# EasyEDA Pro project design.epro, schematic board_bottom_schematic

## Sheets
1 microcontroller: Board Name: board_bottom; Create Date: 2025-03-20; Page Name: microcontroller; Project Name: macropad-final; Schematic Name: board_bottom_schematic; Update Date: 2025-03-23; Company: EasyEDA.com; Page Size: A4; Version: V1.0
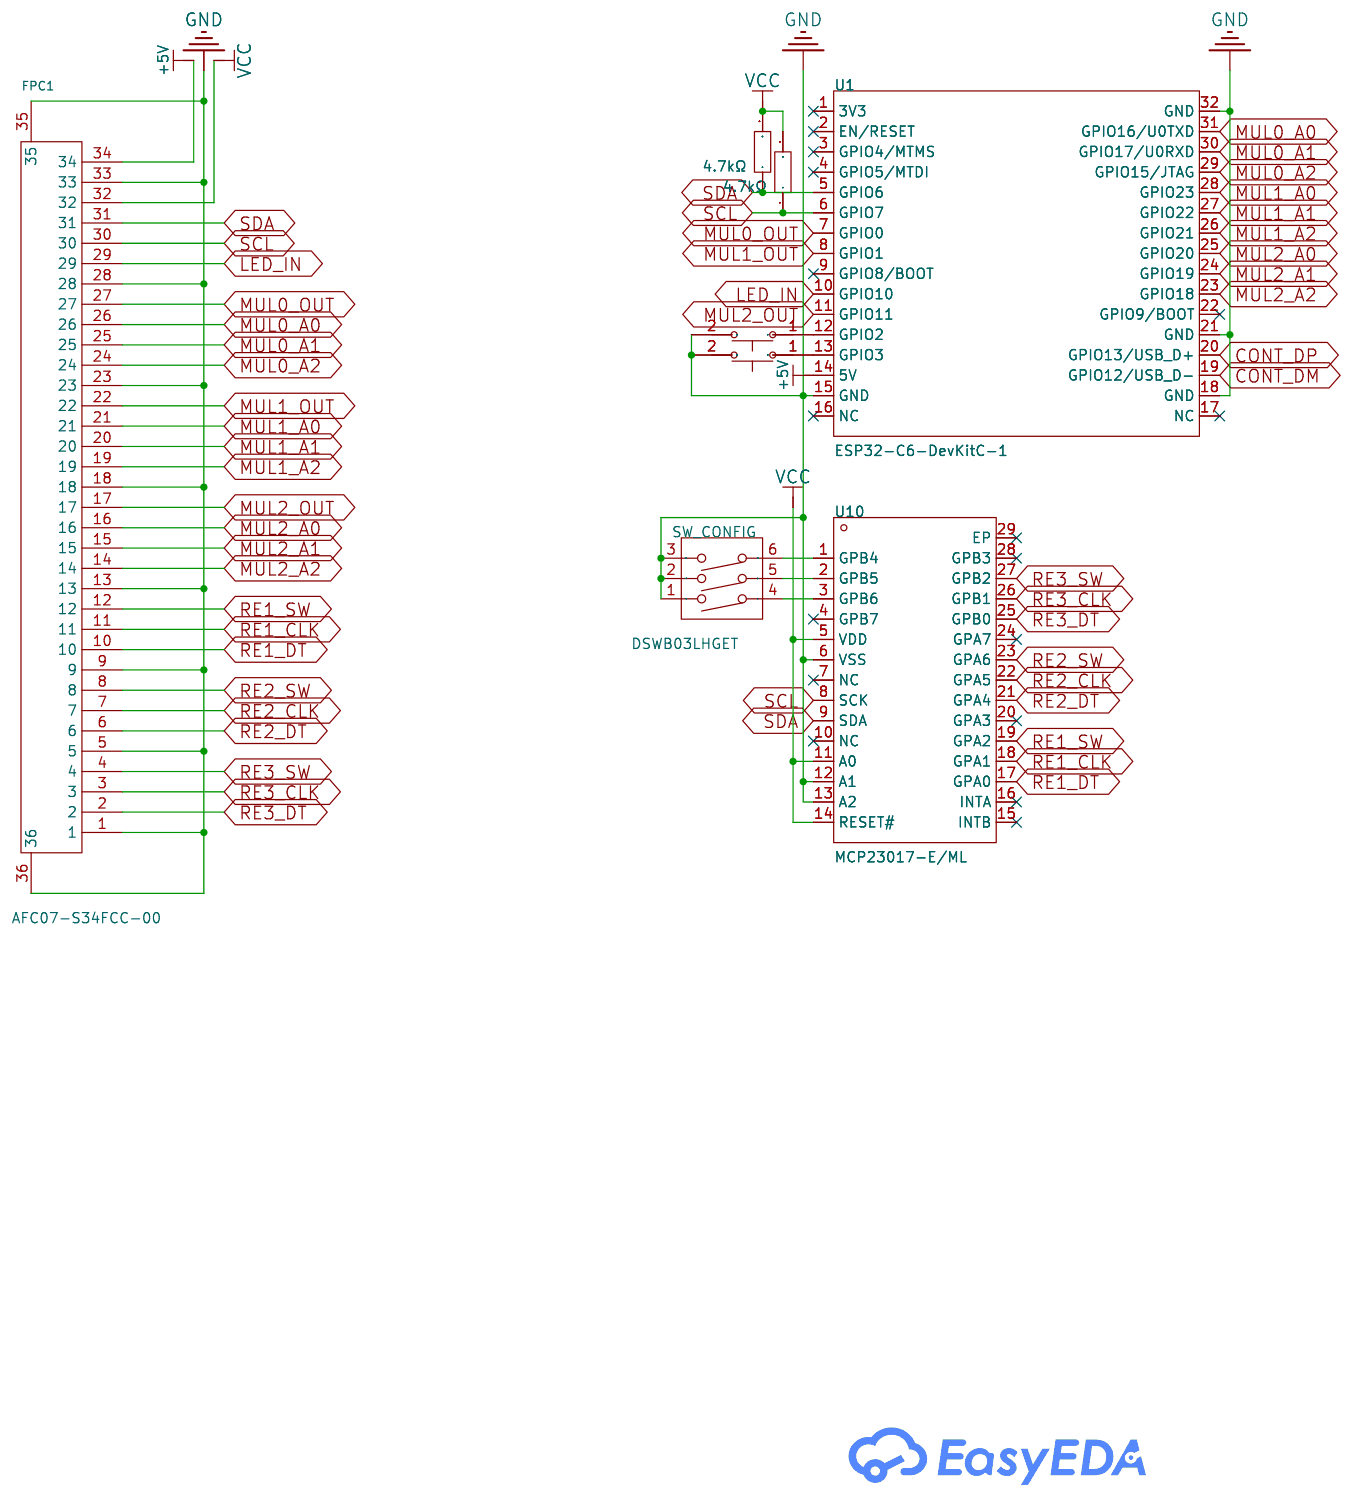
[diagram p0: microcontroller]
2 usb_hub: Create Date: 2025-03-21; Page Name: usb_hub
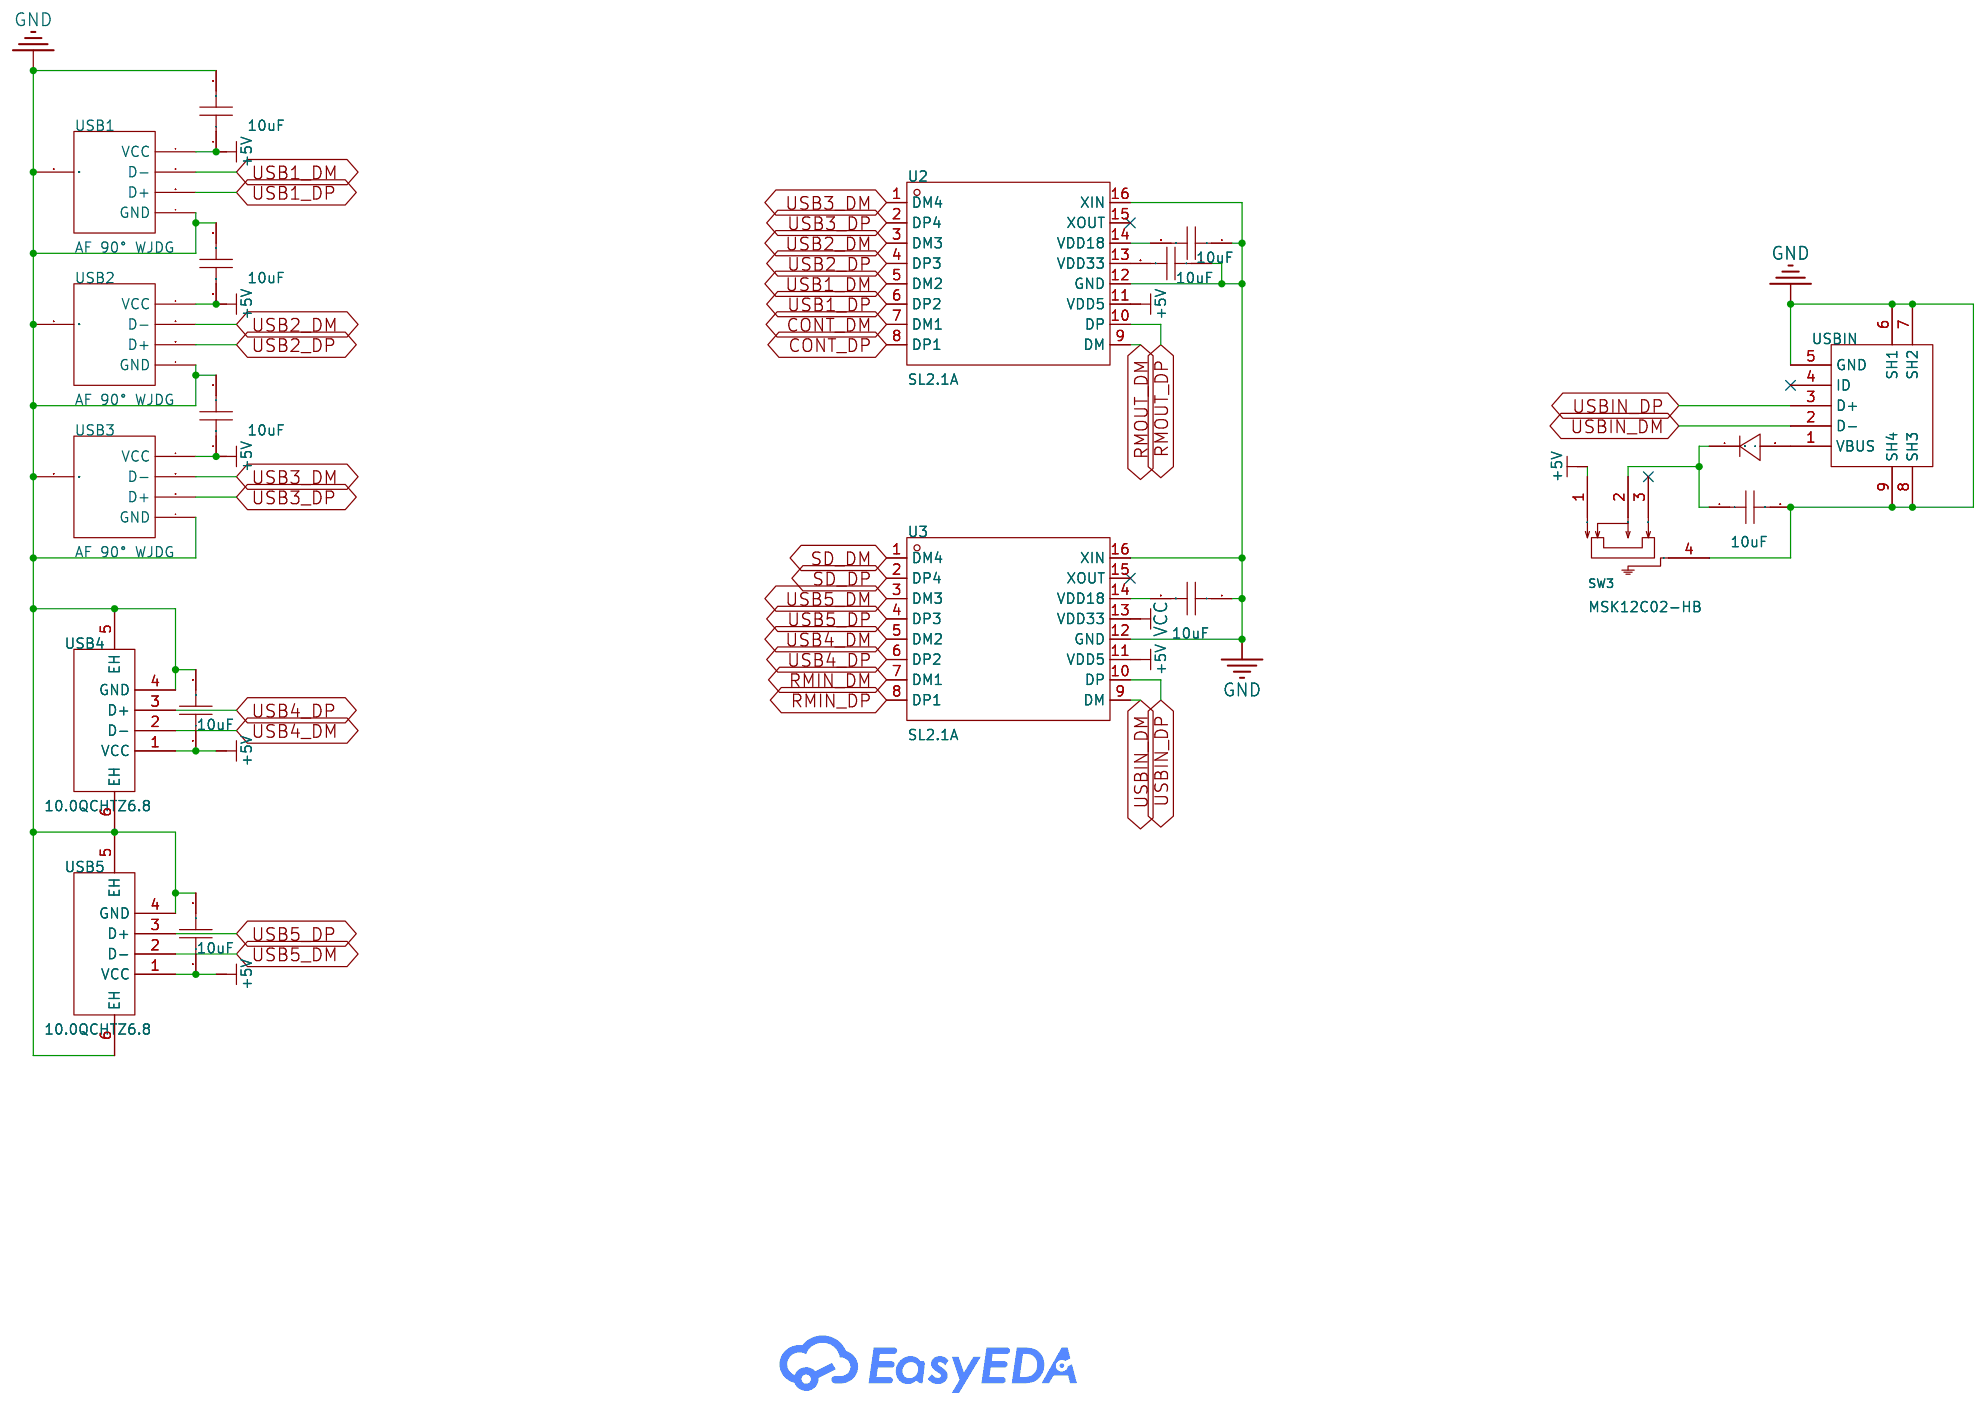
[diagram p1: usb_hub]
3 sd_reader: Create Date: 2025-03-21; Page Name: sd_reader; Update Date: 2025-03-22
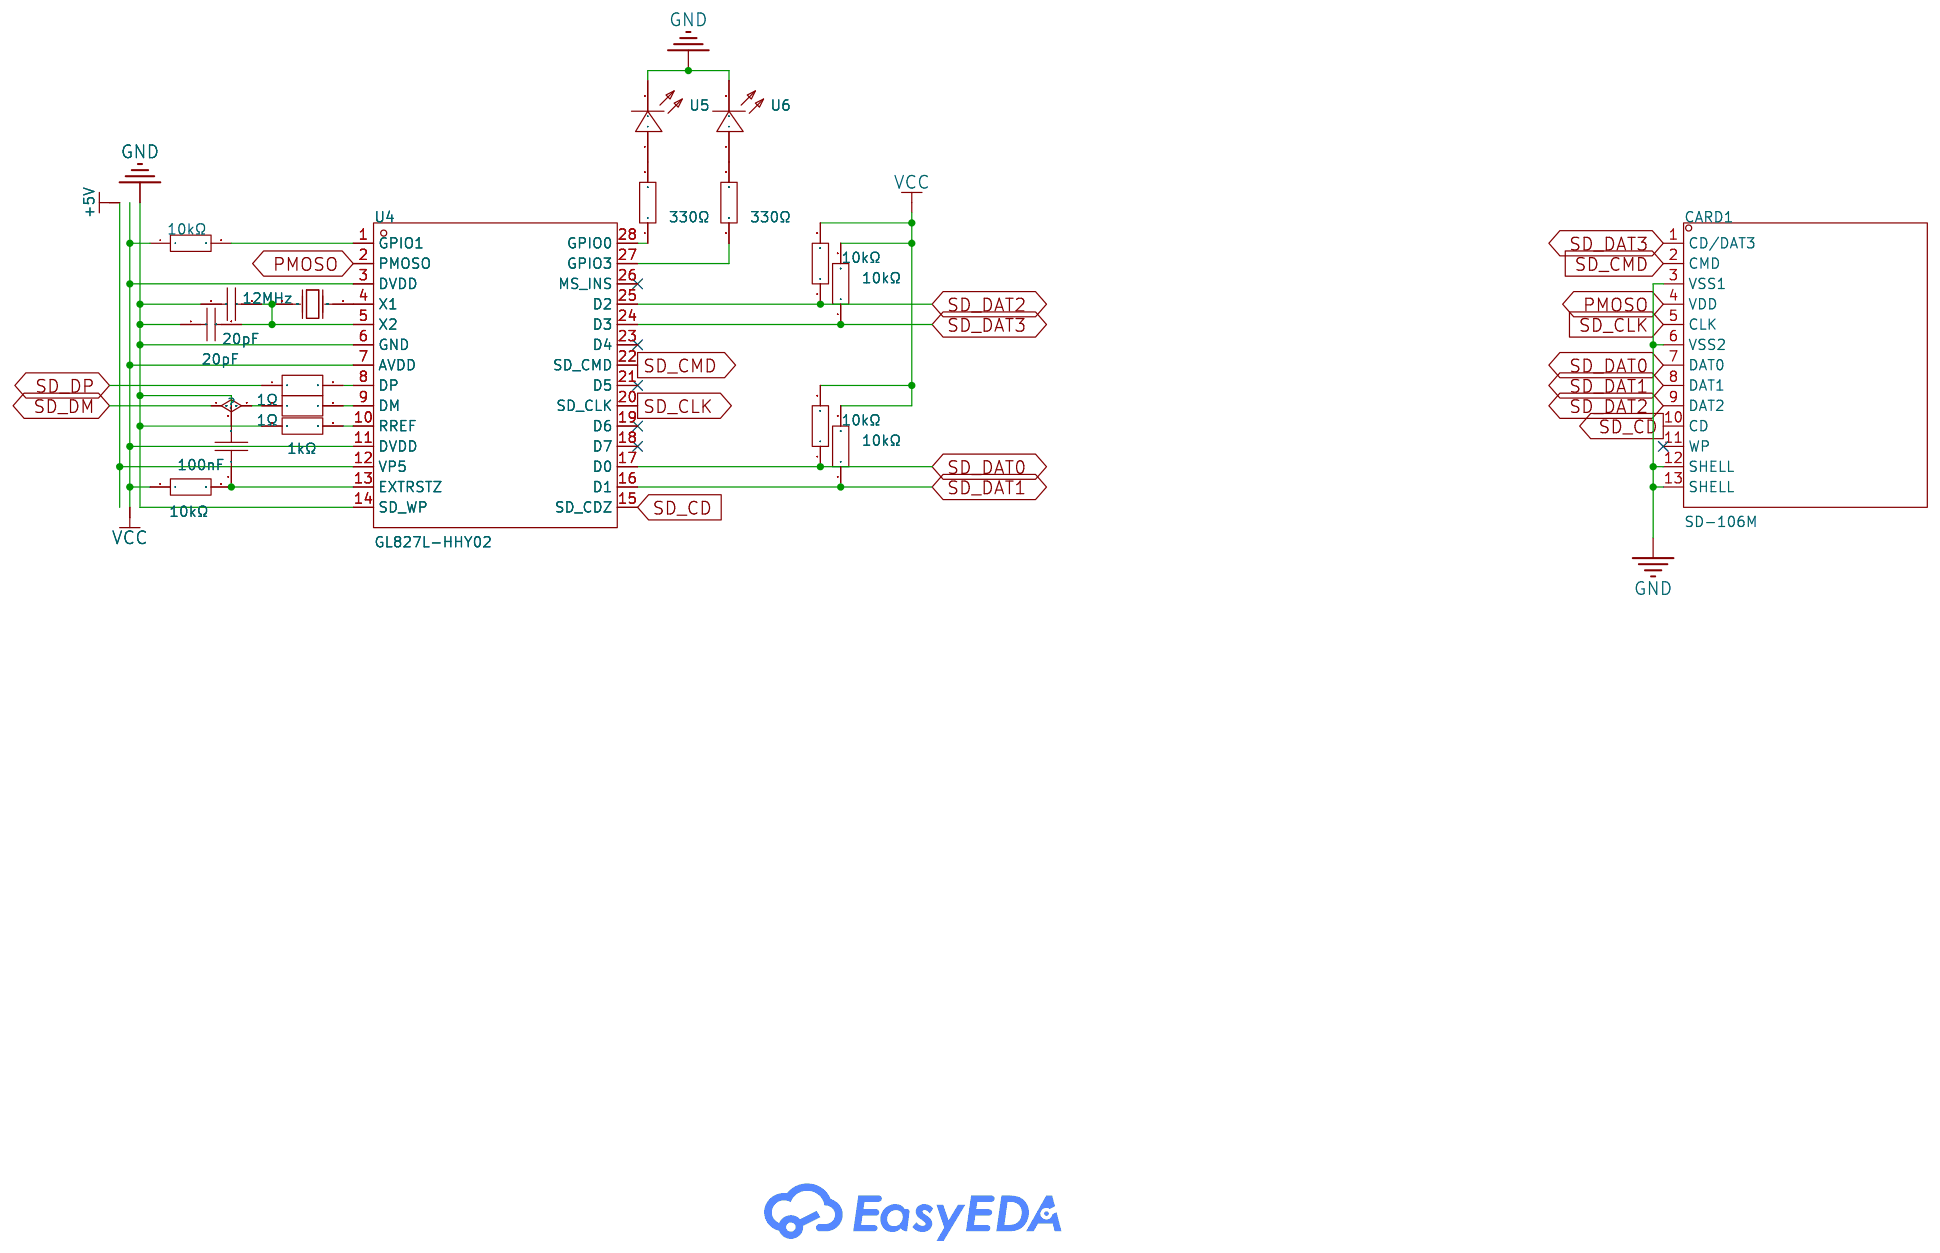
[diagram p2: sd_reader]
4 usb_remapper: Create Date: 2025-03-21; Page Name: usb_remapper
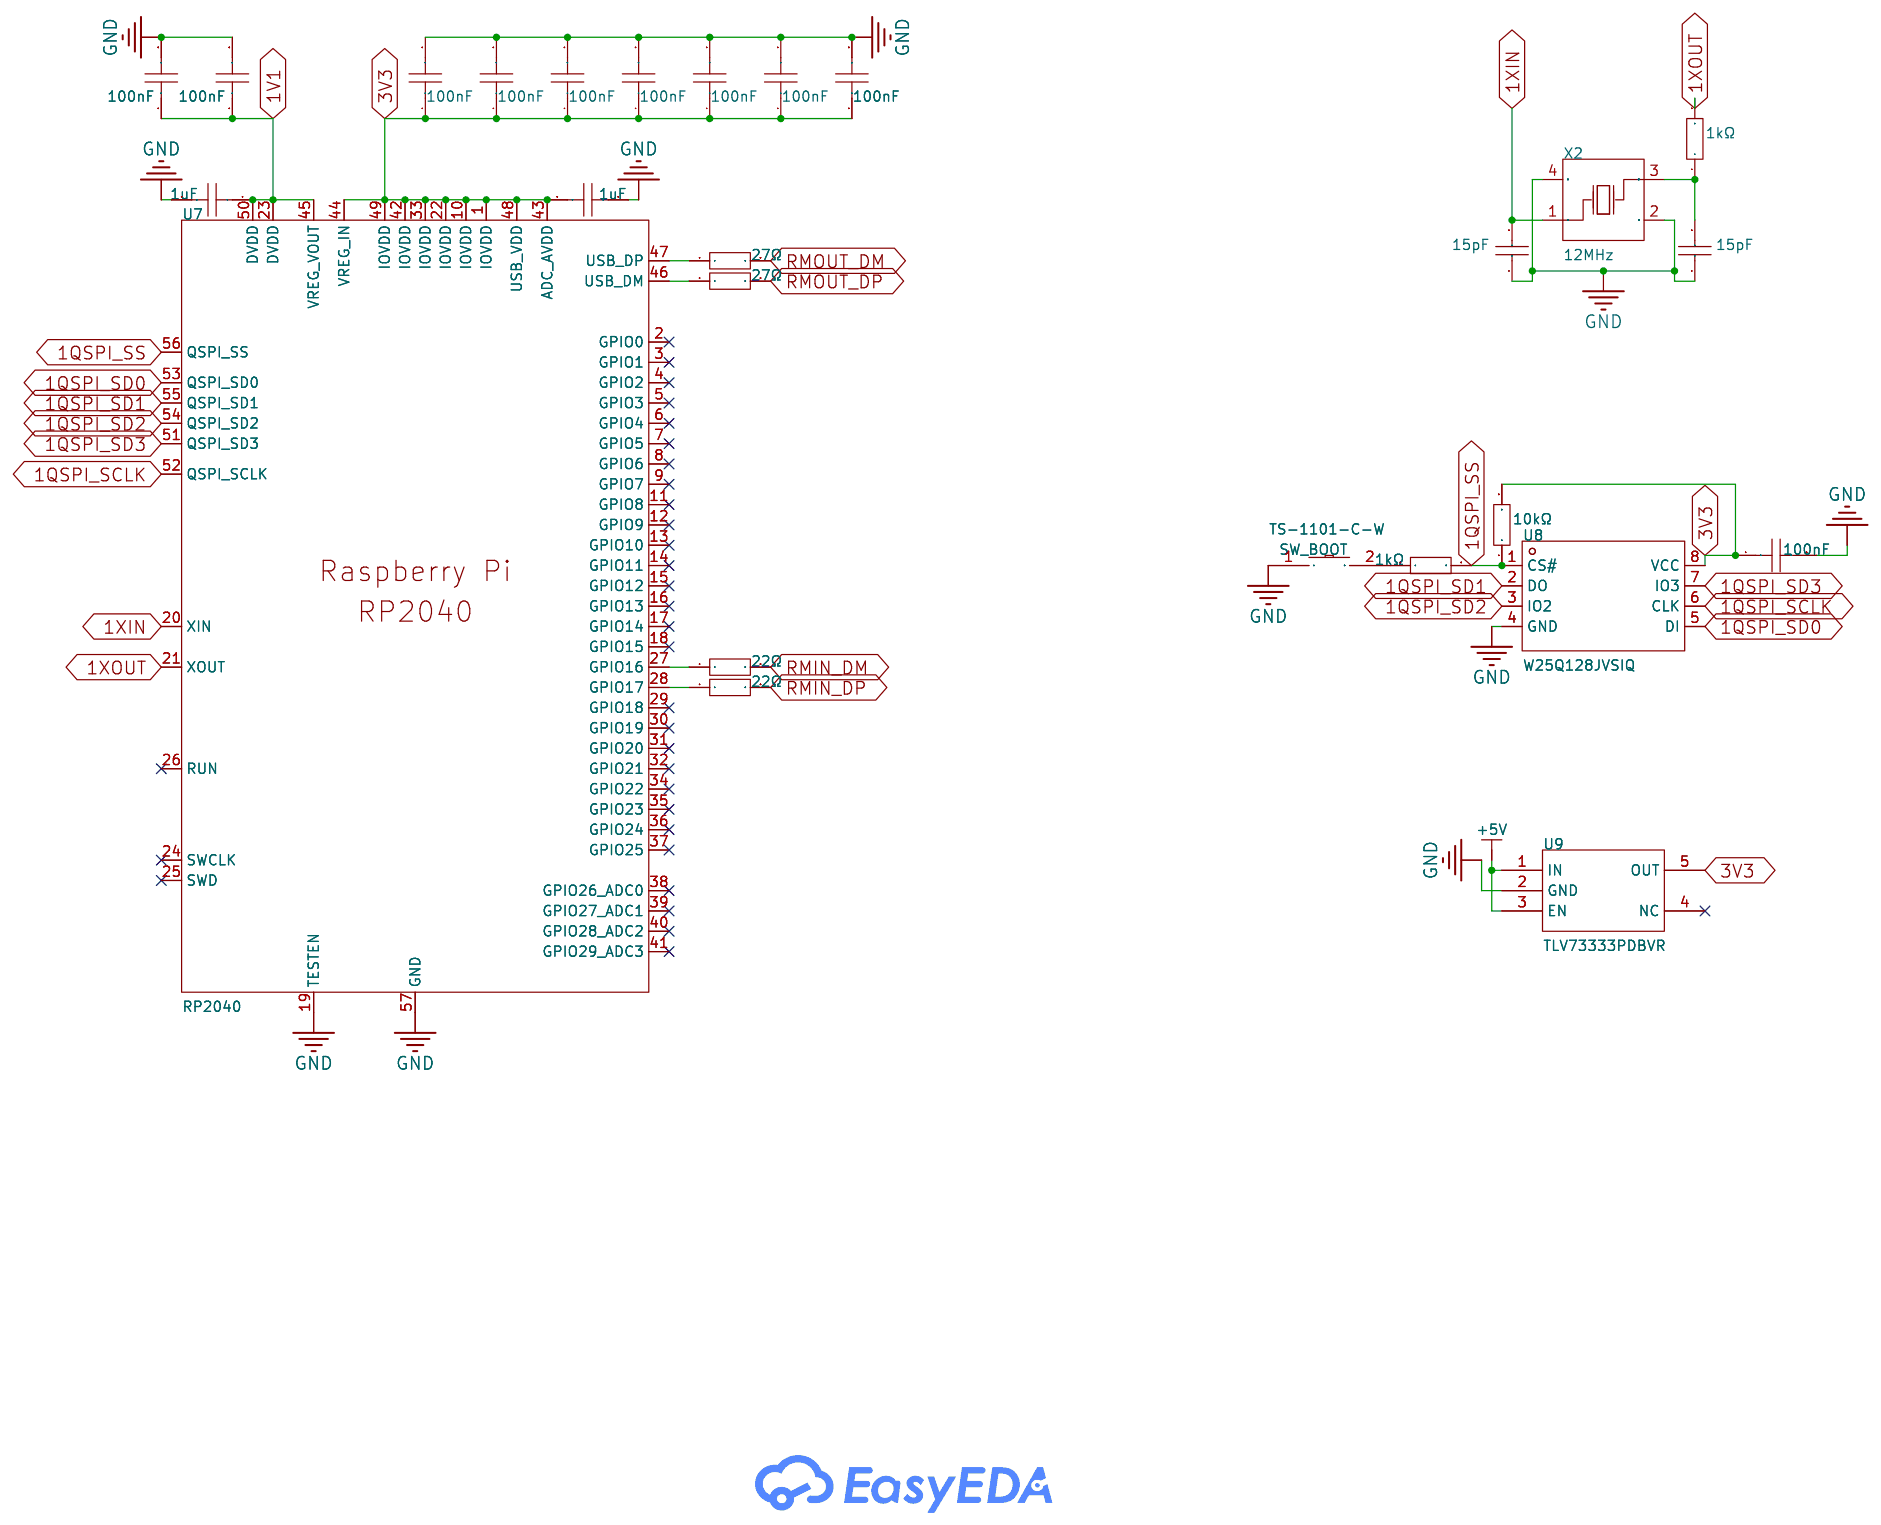
[diagram p3: usb_remapper]

## Parts
sheet microcontroller
FPC1  AFC07-S34FCC-00  [FPC-SMD_P0.50-34P_LCSXJ-H2.0]
R19  4.7kΩ  [R0402]
R20  4.7kΩ  [R0402]
SW1  TS3625A  [KEY-SMD_L6.0-W3.5-LS8.4]
SW2  TS3625A  [KEY-SMD_L6.0-W3.5-LS8.4]
SW_CONFIG  DSWB03LHGET  [SW-TH_DSWB03LHGET]
U1  ESP32-C6-DevKitC-1  [ESP32-C6-DevKitC-1]
U10  MCP23017-E/ML  [QFN-28_L6.0-W6.0-P0.65-BL-EP3.7]
sheet sd_reader
C9  100nF  [C0603]
C10  20pF  [C0402]
C11  20pF  [C0402]
CARD1  SD-106M  [SD-SMD_SD-106M]
R1  1kΩ  [R0603]
R2  10kΩ  [R0603]
R3  10kΩ  [R0603]
R4  330Ω  [R0402]
R5  330Ω  [R0402]
R6  10kΩ  [R0603]
R7  10kΩ  [R0603]
R8  10kΩ  [R0603]
R9  10kΩ  [R0603]
R10  1Ω  [R0805]
R11  1Ω  [R0805]
U4  GL827L-HHY02  [SSOP-28_L9.9-W3.9-P0.64-LS6.0-BL]
U5  APT1608SRCPRV  [LED0603-FD]
U6  APT1608SRCPRV  [LED0603-FD]
X1  12MHz  [HC-49S_L11.4-W4.8]
sheet usb_hub
C1  10uF  [C0805]
C2  10uF  [C0805]
C3  10uF  [C0805]
C4  10uF  [C0805]
C6  10uF  [C0805]
C7  10uF  [C0805]
C8  10uF  [C0805]
C12  10uF  [C0805]
C13  10uF  [C0805]
D1  NSR0320MW2T1G  [SOD-323_L1.8-W1.3-LS2.5-RD]
SW3  MSK12C02-HB  [SW-TH_MSK12C02-HB-1]
U2  SL2.1A  [SOP-16_L10.0-W3.9-P1.27-LS6.0-BL]
U3  SL2.1A  [SOP-16_L10.0-W3.9-P1.27-LS6.0-BL]
USB1  AF 90° WJDG  [USB-A-TH_AF-WJDG]
USB2  AF 90° WJDG  [USB-A-TH_AF-WJDG]
USB3  AF 90° WJDG  [USB-A-TH_AF-WJDG]
USB4  10.0QCHTZ6.8  [USB-A-SMD_10.0QCHTZ6.8]
USB5  10.0QCHTZ6.8  [USB-A-SMD_10.0QCHTZ6.8]
USBIN  MicroXNJ  [MICRO-USB-SMD_MICROXNJ]
sheet usb_remapper
C14  15pF  [C0603]
C15  15pF  [C0603]
C16  100nF  [C0603]
C17  1uF  [C0603]
C18  1uF  [C0603]
C19  100nF  [C0603]
C20  100nF  [C0603]
C21  100nF  [C0603]
C22  100nF  [C0603]
C23  100nF  [C0603]
C24  100nF  [C0603]
C25  100nF  [C0603]
C26  100nF  [C0603]
C27  100nF  [C0603]
R12  27Ω  [R0402]
R13  27Ω  [R0402]
R14  22Ω  [R0402]
R15  22Ω  [R0402]
R16  1kΩ  [R0603]
R17  10kΩ  [R0603]
R18  1kΩ  [R0603]
SW_BOOT  TS-1101-C-W  [SW-SMD_L6.0-W3.3-LS8.0]
U7  RP2040  [LQFN-56_L7.0-W7.0-P0.4-EP]
U8  W25Q128JVSIQ  [SOIC-8_L5.3-W5.3-P1.27-LS8.0-BL]
U9  TLV73333PDBVR  [SOT-23-5_L3.0-W1.7-P0.95-LS2.8-BR]
X2  12MHz  [CRYSTAL-SMD_4P-L3.2-W2.5-BL]

## Library data of the parts
FPC1 = AFC07-S34FCC-00: Locking Feature:抽屉式 Contact Type:Bottom Contact Number of Contacts:34P Pitch:0.5mm Mounting Type:卧贴 FFC, FCB Thickness:0.3mm FFC, FCB Thickness:0.3mm Height Above Board:2mm; LCSC Part Name: 间距:0.5mm P数:34P 抽屉式 下接; Supplier Part: C262221; Manufacturer: JS(钜硕电子); Supplier Footprint: SMD,P=0.5mm,卧贴; JLCPCB Part Class: Extended Part; Datasheet: https://atta.szlcsc.com/upload/public/pdf/source/20190726/C11047_78689421E6D6672DE8D11ECCF89B3729.pdf; Supplier: LCSC; Locking Feature: 抽屉式; Contact Type: Bottom Contact; Number of Contacts: 34P; Pitch: 0.5mm; Mounting Type: 卧贴; FFC, FCB Thickness: 0.3mm; Height Above Board: 2mm
R19 R20 = RC0402FR-074K7L: Type:Thick Film Resistors Resistance: Tolerance:±1% Tolerance:±1% Power(Watts): Overload Voltage (Max): Temperature Coefficient:±100ppm/℃ Temperature Coefficient:±100ppm/℃ Operating Temperature Range:-55℃~+155℃ Operating Temperature Range:-55℃~+155℃; LCSC Part Name: 厚膜电阻 4.7kΩ ±1% 62.5mW; Supplier Part: C105871; Manufacturer: YAGEO(国巨); Supplier Footprint: 0402; JLCPCB Part Class: Extended Part; Datasheet: https://atta.szlcsc.com/upload/public/pdf/source/20180821/C275644_0D56F95EFF785E7D9A1FEF436B37DA78.pdf; Supplier: LCSC; Type: Thick Film Resistors; Tolerance: ±1%; Temperature Coefficient: ±100ppm/℃; Operating Temperature Range: -55℃~+155℃
SW1 SW2 = TS3625A: Circuit:SPST Actuator Style:Rectangle button Operating Force:250gf Mounting Style:Brick nogging Switch Length:6.1mm Switch Width:3.65mm Switch Height:2.5mm Contact Current:50mA Voltage Rating (DC):12V With Lamp:- Mechanical Life:-; LCSC Part Name: 6.1*3.65*2.5mm 立贴 轻触开关; Supplier Part: C398053; Manufacturer: SHOU HAN(首韩); Supplier Footprint: SMD; JLCPCB Part Class: Extended Part; Datasheet: https://atta.szlcsc.com/upload/public/pdf/source/20190620/C398053_EFFFB524A3F966B1F45EE8333D1EDECC.pdf; Supplier: LCSC; Circuit: SPST; Actuator Style: Rectangle button; Operating Force: 250gf; Mounting Style: Brick nogging; Switch Length: 6.1mm; Switch Width: 3.65mm; Switch Height: 2.5mm; Contact Current: 50mA; Voltage Rating (DC): 12V
SW_CONFIG = DSWB03LHGET: Type:平拨,凸起式 Circuit:SPST Number of Positions:3Bit Lead Pitch:2.54mm Operating Life:- Color:Red; LCSC Part Name: 间距2.54mm 平拨,凸起式 3位拨码开关; Supplier Part: C99420; Manufacturer: YE; Supplier Footprint: 插件; JLCPCB Part Class: Extended Part; Datasheet: https://atta.szlcsc.com/upload/public/pdf/source/20170330/1490854274194.pdf; Supplier: LCSC; Type: 平拨,凸起式; Circuit: SPST; Number of Positions: 3Bit; Lead Pitch: 2.54mm; Color: Red
U1 = ESP32-C6-DevKitC-1: _: 3; Check: false
U10 = MCP23017-E/ML: Interface: Number of I/O:16 Interrupt Output:With Interrupt Output Output Type: Supply Voltage:1.8V~5.5V Supply Voltage:1.8V~5.5V Output Source current:- Output Sink Current:- Clock Frequency:- Operating Temperature:-40℃~+125℃ Operating Temperature:-40℃~+; LCSC Part Name: 16位带串行接口的I/O扩展器; Supplier Part: C639770; Manufacturer: MICROCHIP(美国微芯); Supplier Footprint: QFN-28-EP(6x6); JLCPCB Part Class: Extended Part; Datasheet: https://atta.szlcsc.com/upload/public/pdf/source/20221209/1BF939F88C2D907BC056D7BF485E3103.pdf; Supplier: LCSC; Number of I/O: 16; Interrupt Output: With Interrupt Output; Supply Voltage: 1.8V~5.5V; Operating Temperature: -40℃~+125℃
C9 C16 C19-C27 = CGA0603X7R104K500JT: Capacitance:100nF Tolerance:±10% Tolerance:±10% Voltage Rating:50V Temperature Coefficient:X7R; LCSC Part Name: 100nF ±10% 50V; Supplier Part: C6119867; Manufacturer: HRE(芯声); Supplier Footprint: 0603; JLCPCB Part Class: Extended Part; Datasheet: https://atta.szlcsc.com/upload/public/pdf/source/20250103/C44077DA9E7B3EFAE02F22B6D3D1CBC9.pdf; Supplier: LCSC; Tolerance: ±10%; Voltage Rating: 50V; Temperature Coefficient: X7R; Check: true
C10 C11 = CC0402JRNPO9BN200: Capacitance: Tolerance:±5% Tolerance:±5% Voltage Rated: Temperature Coefficient:; LCSC Part Name: 20pF ±5% 50V; Supplier Part: C107000; Manufacturer: YAGEO(国巨); Supplier Footprint: 0402; JLCPCB Part Class: Extended Part; Datasheet: https://atta.szlcsc.com/upload/public/pdf/source/20170914/C128857_1505359892143968080.pdf; Supplier: LCSC; Tolerance: ±5%
CARD1 = SD-106M: Card Connection Mode:Self-bouncing Card Type:Standard SD Card Connector Type:Card Slot Additional Card Detection Pins:- Supplementary Features:- Maximum Body Height:2.9mm Operating Temperature Range:-45℃~+85℃ Operating Temperature Range:-45℃~+85℃; LCSC Part Name: 自弹式 标准SD卡 卡座; Supplier Part: C266603; Manufacturer: XUNPU(讯普); Supplier Footprint: SMD; JLCPCB Part Class: Extended Part; Datasheet: https://atta.szlcsc.com/upload/public/pdf/source/20210906/8CAB298B0B65163F8BCA33441A7CD5E8.pdf; Supplier: LCSC; Card Connection Mode: Self-bouncing; Card Type: Standard SD Card; Connector Type: Card Slot; Maximum Body Height: 2.9mm; Operating Temperature Range: -45℃~+85℃; Check: true
R1 R16 R18 = RC0603FR-071KL: Type:Thick Film Resistors Resistance: Tolerance:±1% Tolerance:±1% Power(Watts): Overload Voltage (Max): Temperature Coefficient:±100ppm/℃ Temperature Coefficient:±100ppm/℃ Operating Temperature Range:-55℃~+155℃ Operating Temperature Range:-55℃~+155℃; LCSC Part Name: 厚膜电阻 1kΩ ±1% 100mW; Supplier Part: C22548; Manufacturer: YAGEO(国巨); Supplier Footprint: 0603; JLCPCB Part Class: Extended Part; Datasheet: https://atta.szlcsc.com/upload/public/pdf/source/20180316/70C0E2BDAE7FCC62C531A5A58D202EE1.pdf; Supplier: LCSC; Type: Thick Film Resistors; Tolerance: ±1%; Temperature Coefficient: ±100ppm/℃; Operating Temperature Range: -55℃~+155℃; Check: true
R2 R3 R6-R9 R17 = 0603WAF1002T5E: Type:Thick Film Resistors Resistance:10kΩ Tolerance:±1% Tolerance:±1% Power(Watts): Overload Voltage (Max): Temperature Coefficient:±100ppm/℃ Temperature Coefficient:±100ppm/℃ Operating Temperature Range:-55℃~+155℃ Operating Temperature Range:-55℃~+155℃; LCSC Part Name: 厚膜电阻 10kΩ ±1% 100mW; Supplier Part: C25804; Manufacturer: UNI-ROYAL(厚声); Supplier Footprint: 0603; JLCPCB Part Class: Basic Part; Datasheet: https://atta.szlcsc.com/upload/public/pdf/source/20200306/C422600_1E6D84923E4A46A82E41ADD87F860B5C.pdf; Supplier: LCSC; Type: Thick Film Resistors; Tolerance: ±1%; Temperature Coefficient: ±100ppm/℃; Operating Temperature Range: -55℃~+155℃; Check: true
R4 R5 = RC0402FR-07330RL: Type:Thick Film Resistors Resistance: Tolerance:±1% Tolerance:±1% Power(Watts): Overload Voltage (Max): Temperature Coefficient:±100ppm/℃ Temperature Coefficient:±100ppm/℃ Operating Temperature Range:-55℃~+155℃ Operating Temperature Range:-55℃~+155℃; LCSC Part Name: 厚膜电阻 330Ω ±1% 62.5mW; Supplier Part: C105875; Manufacturer: YAGEO(国巨); Supplier Footprint: 0402; JLCPCB Part Class: Extended Part; Datasheet: https://atta.szlcsc.com/upload/public/pdf/source/20180821/C275644_0D56F95EFF785E7D9A1FEF436B37DA78.pdf; Supplier: LCSC; Type: Thick Film Resistors; Tolerance: ±1%; Temperature Coefficient: ±100ppm/℃; Operating Temperature Range: -55℃~+155℃; Check: true
R10 R11 = FRC0805J1R0TS: Type:Thick Film Resistors Resistance:1Ω Tolerance:±5% Tolerance:±5% Power(Watts):0.125W Voltage-Supply(Max):150V Temperature Coefficient:±200ppm/℃ Temperature Coefficient:±200ppm/℃ Operating Temperature:-55℃~+155℃ Operating Temperature:-55℃~+155℃; LCSC Part Name: 1Ω ±5% 125mW 厚膜电阻; Supplier Part: C2930253; Manufacturer: FOJAN(富捷); Supplier Footprint: 0805; JLCPCB Part Class: Extended Part; Datasheet: https://atta.szlcsc.com/upload/public/pdf/source/20211221/925EC7D7225764EE0046F22065062C87.pdf; Supplier: LCSC; Type: Thick Film Resistors; Tolerance: ±5%; Power(Watts): 0.125W; Voltage-Supply(Max): 150V; Temperature Coefficient: ±200ppm/℃; Operating Temperature: -55℃~+155℃; Check: true
U4 = GL827L-HHY02: Applications Function:Controller Protocol:; LCSC Part Name: GL827L USB 2.0单槽卡读取控制器; Supplier Part: C161839; Manufacturer: GENESYS(创惟); Supplier Footprint: SSOP-28-150mil; JLCPCB Part Class: Extended Part; Datasheet: https://atta.szlcsc.com/upload/public/pdf/source/20180224/C161839_15194365215191363557.pdf; Supplier: LCSC; Applications Function: Controller; Check: true
U5 U6 = APT1608SRCPRV: Emitted Color:Red Forward Voltage (VF):1.85V Forward Voltage (VF):1.85V Forward Current:20mA Dominant Wavelength:640nm Dominant Wavelength:640nm Peak Wavelength:655nm Lens Color:无色透明透镜 Luminous Intensity:30mcd Luminous Intensity:30mcd Viewing Angle:120°; LCSC Part Name: APT1608SRCPRV 停产; Supplier Part: C5878878; Manufacturer: Kingbright; Supplier Footprint: 0603; JLCPCB Part Class: Extended Part; Supplier: LCSC; Emitted Color: Red; Forward Voltage (VF): 1.85V; Forward Current: 20mA; Dominant Wavelength: 640nm; Peak Wavelength: 655nm; Lens Color: 无色透明透镜; Luminous Intensity: 30mcd; Viewing Angle: 120°
X1 = X49SM12MSD2SC: Type:Surface Mount Crystal Frequency:12MHz Normal temperature Frequency Tolerance:±20ppm Normal temperature Frequency Tolerance:±20ppm Load Capacitance: Frequency Stability:±30ppm Frequency Stability:±30ppm Operating Temperature:-20℃~+70℃ Operating Temper; LCSC Part Name: 12MHz ±20ppm 20pF; Supplier Part: C14871; Manufacturer: YXC(扬兴晶振); Supplier Footprint: HC-49S-SMD; JLCPCB Part Class: Extended Part; Datasheet: https://atta.szlcsc.com/upload/public/pdf/source/20240329/3EBF42EBCAB50CA65B6FA9D7CFA1955A.pdf; Supplier: LCSC; Type: Surface Mount Crystal; Normal temperature Frequency Tolerance: ±20ppm; Frequency Stability: ±30ppm; Operating Temperature: -20℃~+70℃; Check: true
C1-C4 C6-C8 C12 C13 = CL21A106KAYNNNE_C15850: Capacitance: Tolerance:±10% Tolerance:±10% Voltage Rated: Temperature Coefficient:; LCSC Part Name: 10uF ±10% 25V; Supplier Part: C15850; Manufacturer: SAMSUNG(三星); Manufacturer Part: CL21A106KAYNNNE; Supplier Footprint: 0805; JLCPCB Part Class: Basic Part; Datasheet: https://atta.szlcsc.com/upload/public/pdf/source/20160218/1457707763339.pdf; Supplier: LCSC; Tolerance: ±10%; Check: true
D1 = NSR0320MW2T1G: Forward Voltage (Vf@If):500mV@900mA Reverse Voltage (Vr):20V Average Rectified Current (Io):1A Reverse Leakage Current (Ir):50uA@15V; LCSC Part Name: 电压:20V 电流:1A; Supplier Part: C48192; Manufacturer: onsemi(安森美); Supplier Footprint: SOD-323; JLCPCB Part Class: Extended Part; Datasheet: https://atta.szlcsc.com/upload/public/pdf/source/20170225/1488010654203.PDF; Supplier: LCSC; Forward Voltage (Vf@If): 500mV@900mA; Reverse Voltage (Vr): 20V; Average Rectified Current (Io): 1A; Reverse Leakage Current (Ir): 50uA@15V; Check: true
SW3 = MSK12C02-HB: Circuit:SPDT Actuator Style:- Pin Style:SMDSplicing Switch Length:8mm Switch Width:2.8mm Switch Height:1.4mm Mounting Style:卧贴 Actuator Color:- Current Rating (DC):50mA Voltage Rating (DC):12V Current Rating (AC):- Voltage Rating (AC):- Mechanical Life:1万; LCSC Part Name: 两档侧拨贴片 7脚拨动 黑柄,柄长1.5mm,带定位柱; Supplier Part: C431541; Manufacturer: SHOU HAN(首韩); Supplier Footprint: SMD; JLCPCB Part Class: Extended Part; Datasheet: https://atta.szlcsc.com/upload/public/pdf/source/20190925/C431541_43A76A06FD86AD8E3069A6BFECE3ABC5.pdf; Supplier: LCSC; Circuit: SPDT; Pin Style: SMDSplicing; Switch Length: 8mm; Switch Width: 2.8mm; Switch Height: 1.4mm; Mounting Style: 卧贴; Current Rating (DC): 50mA; Voltage Rating (DC): 12V; Mechanical Life: 1万次; Operating Temperature: -20℃~+70℃
U2 U3 = SL2.1A: LCSC Part Name: USB2.0高速4端口HUB控制器; Supplier Part: C192893; Manufacturer: CoreChips(和芯润德); Supplier Footprint: SOP-16; JLCPCB Part Class: Extended Part; Datasheet: https://atta.szlcsc.com/upload/public/pdf/source/20180522/C192893_624110D24898D57AAC785E3DF98EA862.pdf; Supplier: LCSC; Check: true
USB1-USB3 = AF 90° WJDG: Connector Type:Type-A Standard:USB 2.0 Gender:Mother Mounting Style:Bend-in Number of Contacts:4P Number of Ports:1 Current Rating - Power (Max):1.5A Rated Voltage (Max):30V Connect-Disconnect Life:5000 Cuts Supplementary Features:- Center Height:- Length; LCSC Part Name: Type-A 母 弯插; Supplier Part: C456018; Manufacturer: SHOU HAN(首韩); Supplier Footprint: 插件; JLCPCB Part Class: Extended Part; Datasheet: https://atta.szlcsc.com/upload/public/pdf/source/20241125/1CC41152EE29FFE03A5868591A920D3B.pdf; Supplier: LCSC; Connector Type: Type-A; Standard: USB 2.0; Gender: Mother; Mounting Style: Bend-in; Number of Contacts: 4P; Number of Ports: 1; Current Rating - Power (Max): 1.5A; Rated Voltage (Max): 30V; Connect-Disconnect Life: 5000 Cuts; Length: 14mm; Core Colour: White; Operating Temperature Range: -25℃~+85℃; Check: true
USB4 USB5 = 10.0QCHTZ6.8: Connector Type:Type-A Standard:USB 2.0 Gender:Mother Mounting Style:Horizontal attachment Number of Contacts:4P Number of Ports:1 Current Rating - Power (Max):1.5A Rated Voltage (Max):30V Connect-Disconnect Life:5000 Cuts Supplementary Features:- Center H; LCSC Part Name: Type-A 母 卧贴; Supplier Part: C404967; Manufacturer: SHOU HAN(首韩); Supplier Footprint: SMD; JLCPCB Part Class: Extended Part; Datasheet: https://atta.szlcsc.com/upload/public/pdf/source/20241125/1CA9EBF7CFFDAA9995BCAADB5815485D.pdf; Supplier: LCSC; Connector Type: Type-A; Standard: USB 2.0; Gender: Mother; Mounting Style: Horizontal attachment; Number of Contacts: 4P; Number of Ports: 1; Current Rating - Power (Max): 1.5A; Rated Voltage (Max): 30V; Connect-Disconnect Life: 5000 Cuts; Length: 10mm; Core Colour: Black; Operating Temperature Range: -25℃~+85℃; Check: true
USBIN = MicroXNJ: Connector Type:Micro-B Standard:USB 2.0 Gender:Female Mounting Style:Horizontal attachment Number of Contacts:5P Number of Ports:1 Current Rating - Power (Max):1.8A Operating Temperature Range:-20℃~+85℃ Operating Temperature Range:-20℃~+85℃ Rated Voltage; LCSC Part Name: Micro-B 母 卧贴; Supplier Part: C404969; Manufacturer: SHOU HAN(首韩); Supplier Footprint: SMD; JLCPCB Part Class: Extended Part; Datasheet: https://atta.szlcsc.com/upload/public/pdf/source/20220415/2494EDFF499AF6F852F7C820374B6AF3.pdf; Supplier: LCSC; Connector Type: Micro-B; Standard: USB 2.0; Gender: Female; Mounting Style: Horizontal attachment; Number of Contacts: 5P; Number of Ports: 1; Current Rating - Power (Max): 1.8A; Operating Temperature Range: -20℃~+85℃; Rated Voltage (Max): 30V; Connect-Disconnect Life: 5000 Cuts; Core Colour: Black; Check: true
C14 C15 = CC0603JRNPO9BN150: Capacitance: Tolerance:±5% Tolerance:±5% Voltage Rated: Temperature Coefficient:; LCSC Part Name: 15pF ±5% 50V; Supplier Part: C107037; Manufacturer: YAGEO(国巨); Supplier Footprint: 0603; JLCPCB Part Class: Extended Part; Datasheet: https://atta.szlcsc.com/upload/public/pdf/source/20170914/C128857_1505359892143968080.pdf; Supplier: LCSC; Tolerance: ±5%; Check: true
C17 C18 = CGA0603X5R105K160JT: Capacitance:1uF Tolerance:±10% Tolerance:±10% Voltage Rating:16V Temperature Coefficient:X5R; LCSC Part Name: 1uF ±10% 16V; Supplier Part: C6119849; Manufacturer: HRE(芯声); Supplier Footprint: 0603; JLCPCB Part Class: Extended Part; Supplier: LCSC; Tolerance: ±10%; Voltage Rating: 16V; Temperature Coefficient: X5R; Check: true
R12 R13 = RC0402FR-0727RL: Type:Thick Film Resistors Resistance: Tolerance:±1% Tolerance:±1% Power(Watts): Overload Voltage (Max): Temperature Coefficient:±100ppm/℃ Temperature Coefficient:±100ppm/℃ Operating Temperature Range:-55℃~+155℃ Operating Temperature Range:-55℃~+155℃; LCSC Part Name: 厚膜电阻 27Ω ±1% 62.5mW; Supplier Part: C138021; Manufacturer: YAGEO(国巨); Supplier Footprint: 0402; JLCPCB Part Class: Extended Part; Datasheet: https://atta.szlcsc.com/upload/public/pdf/source/20181009/C309620_DA5935B6E1D48212CB7A533FE518B3C2.pdf; Supplier: LCSC; Type: Thick Film Resistors; Tolerance: ±1%; Temperature Coefficient: ±100ppm/℃; Operating Temperature Range: -55℃~+155℃; Check: true
R14 R15 = RC0402FR-0722RL: Type:Thick Film Resistors Resistance: Tolerance:±1% Tolerance:±1% Power(Watts): Overload Voltage (Max): Temperature Coefficient:±100ppm/℃ Temperature Coefficient:±100ppm/℃ Operating Temperature Range:-55℃~+155℃ Operating Temperature Range:-55℃~+155℃; LCSC Part Name: 厚膜电阻 22Ω ±1% 62.5mW; Supplier Part: C114765; Manufacturer: YAGEO(国巨); Supplier Footprint: 0402; JLCPCB Part Class: Extended Part; Datasheet: https://atta.szlcsc.com/upload/public/pdf/source/20180821/C275644_0D56F95EFF785E7D9A1FEF436B37DA78.pdf; Supplier: LCSC; Type: Thick Film Resistors; Tolerance: ±1%; Temperature Coefficient: ±100ppm/℃; Operating Temperature Range: -55℃~+155℃; Check: true
SW_BOOT = TS-1101-C-W: Circuit:SPST Actuator Style:Rectangle button Operating Force:260gf Mounting Style:Brick nogging Switch Length:6mm Switch Width:3.6mm Switch Height:2.5mm Strike Gundam:不带 Contact Current:50mA Voltage Rating (AC):- Voltage Rating (DC):12V Power Rating:- Ins; LCSC Part Name: 6*3.6*2.5mm 立贴 轻触开关; Supplier Part: C318938; Manufacturer: XKB Connectivity(中国星坤); Supplier Footprint: SMD; JLCPCB Part Class: Extended Part; Datasheet: https://atta.szlcsc.com/upload/public/pdf/source/20200227/C318938_C2E53B1EEDE37D980A33616AC086DE53.pdf; Supplier: LCSC; Circuit: SPST; Actuator Style: Rectangle button; Operating Force: 260gf; Mounting Style: Brick nogging; Switch Length: 6mm; Switch Width: 3.6mm; Switch Height: 2.5mm; Strike Gundam: 不带; Contact Current: 50mA; Voltage Rating (DC): 12V; Actuator/Cap Color: 白色带淡绿; With Lamp: No; Mechanical Life: 5万次; Operating Temperature: -30℃~+85℃; Check: true
U7 = RP2040_C2040: CPU Core:- CPU Maximum Speed:133MHz Number of I/O:30 ADC (Bit):12bit Applications:-; LCSC Part Name: RP2040（RP2B2）; Supplier Part: C2040; Manufacturer: Raspberry Pi(树莓派); Supplier Footprint: LQFN-56(7x7); JLCPCB Part Class: Extended Part; Datasheet: https://atta.szlcsc.com/upload/public/pdf/source/20210621/C2040_96F425825606B7957D87DD32E2512CA9.pdf; Supplier: LCSC; CPU Maximum Speed: 133MHz; Number of I/O: 30; ADC (Bit): 12bit; Check: true
U8 = W25Q128JVSIQ: Interface Type:SPI Memory Size:128Mbit Clock Frequency (fc):133MHz Supply Voltage:2.7V~3.6V Supply Voltage:2.7V~3.6V Page Programming Time (Tpp):700us Block Erase Time (tBE):120ms@(32KB) Data Retention - TDR (Year):20 years Operating Temperature:-40℃~+85℃; LCSC Part Name: W25Q128JVSIQ 编带; Supplier Part: C97521; Manufacturer: WINBOND(华邦); Supplier Footprint: SOIC-8-208mil; JLCPCB Part Class: Basic Part; Datasheet: https://atta.szlcsc.com/upload/public/pdf/source/20170316/1489627409956.pdf; Supplier: LCSC; Interface Type: SPI; Memory Size: 128Mbit; Clock Frequency (fc): 133MHz; Supply Voltage: 2.7V~3.6V; Page Programming Time (Tpp): 700us; Block Erase Time (tBE): 120ms@(32KB); Data Retention - TDR (Year): 20 years; Operating Temperature: -40℃~+85℃; Check: true
U9 = TLV73333PDBVR: Output Type:Fixed Maximum Input Voltage:5.5V Output Voltage:3.3V Output Voltage:3.3V Output Current:300mA Power Supply Rejection Ratio (PSRR):68dB@(100Hz)；28dB@(100kHz) Dropout Voltage:270mV@(300mA) standby current:60uA Feature:ESD Protection；Surge Protec; LCSC Part Name: 具有使能功能的 300mA、低 IQ、低压降无电容稳压器; Supplier Part: C134139; Manufacturer: TI(德州仪器); Supplier Footprint: SOT-23-5; JLCPCB Part Class: Extended Part; Datasheet: https://www.ti.com/cn/lit/gpn/tlv733p; Supplier: LCSC; Output Type: Fixed; Maximum Input Voltage: 5.5V; Output Voltage: 3.3V; Output Current: 300mA; Power Supply Rejection Ratio (PSRR): 68dB@(100Hz)；28dB@(100kHz); Dropout Voltage: 270mV@(300mA); standby current: 60uA; Feature: ESD Protection；Surge Protection；Automatic Discharge Function；Low ESR；Thermal Protection(TSD)；Under-voltage Lockout；Overcurrent Protection(OCP)；With ability；Anti-Siphon; Operating Temperature: -40℃~+125℃@(Tj); Output Polarity: Positive electrode; Number of Outputs: 1; Check: true
X2 = X322512MSB4SI: Crystal Type:Surface Mount Crystal Frequency: Normal temperature Frequency Tolerance:±10ppm Normal temperature Frequency Tolerance:±10ppm External load capacitor: Frequency Stability(Full temperature range):±20ppm Frequency Stability(Full temperature rang; LCSC Part Name: 12MHz ±10ppm 20pF; Supplier Part: C9002; Manufacturer: YXC(扬兴晶振); Supplier Footprint: SMD3225-4P; JLCPCB Part Class: Basic Part; Datasheet: https://atta.szlcsc.com/upload/public/pdf/source/20240329/19D5F850207469550BEB00D7DFEDBC7A.pdf; Supplier: LCSC; Crystal Type: Surface Mount Crystal; Normal temperature Frequency Tolerance: ±10ppm; Frequency Stability(Full temperature range): ±20ppm; Check: true

## Nets
1V1: C17.1 C19.1 C20.1 U7.23(DVDD) U7.45(VREG_VOUT) U7.50(DVDD)
3V3: C16.1 C18.2 C21.1 C22.1 C23.1 C24.1 C25.1 C26.1 C27.1 R17.2 U7.1(IOVDD) U7.10(IOVDD) U7.22(IOVDD) U7.33(IOVDD) U7.42(IOVDD) U7.43(ADC_AVDD) U7.44(VREG_IN) U7.48(USB_VDD) U7.49(IOVDD) U8.8(VCC) U9.5(OUT)
+5V: C2.1 C3.1 C4.1 C12.1 C13.1 FPC1.34 SW3.1 U1.14(5V) U2.11(VDD5) U3.11(VDD5) U4.12(VP5) U9.1(IN) U9.3(EN) USB1.1(VCC) USB2.1(VCC) USB3.1(VCC) USB4.1(VCC) USB5.1(VCC)
GND: C1.2 C2.2 C3.2 C4.2 C6.1 C7.1 C8.1 C9.2 C10.1 C11.1 C12.2 C13.2 C14.1 C15.1 C16.2 C17.2 C18.1 C19.2 C20.2 C21.2 C22.2 C23.2 C24.2 C25.2 C26.2 C27.2 CARD1.3(VSS1) CARD1.6(VSS2) CARD1.12(SHELL) CARD1.13(SHELL) FPC1.1 FPC1.5 FPC1.9 FPC1.13 FPC1.18 FPC1.23 FPC1.28 FPC1.33 FPC1.35 FPC1.36 R1.1 SW1.2 SW2.2 SW3.4 SW_BOOT.1 SW_CONFIG.1 SW_CONFIG.2 SW_CONFIG.3 U1.15(GND) U1.18(GND) U1.21(GND) U1.32(GND) U2.12(GND) U2.16(XIN) U3.12(GND) U3.16(XIN) U4.6(GND) U4.14(SD_WP) U5.2(K) U6.2(K) U7.19(TESTEN) U7.57(GND) U8.4(GND) U9.2(GND) U10.6(VSS) U10.12(A1) U10.13(A2) USB1.4(GND) USB1.5(SHLD) USB2.4(GND) USB2.5(SHLD) USB3.4(GND) USB3.5(SHLD) USB4.4(GND) USB4.5(EH) USB4.6(EH) USB5.4(GND) USB5.5(EH) USB5.6(EH) USBIN.5(GND) USBIN.6(SH1) USBIN.7(SH2) USBIN.8(SH3) USBIN.9(SH4) X2.2(GND) X2.4(GND)
VCC: FPC1.32 R2.1 R3.1 R6.2 R7.2 R8.2 R9.2 R19.2 R20.2 U3.13(VDD33) U4.3(DVDD) U4.7(AVDD) U4.11(DVDD) U10.5(VDD) U10.11(A0) U10.14(RESET#)
1QSPI_SCLK: U7.52(QSPI_SCLK) U8.6(CLK)
1QSPI_SD0: U7.53(QSPI_SD0) U8.5(DI)
1QSPI_SD1: U7.55(QSPI_SD1) U8.2(DO)
1QSPI_SD2: U7.54(QSPI_SD2) U8.3(IO2)
1QSPI_SD3: U7.51(QSPI_SD3) U8.7(IO3)
1QSPI_SS: R17.1 R18.2 U7.56(QSPI_SS) U8.1(CS#)
1XIN: C15.2 U7.20(XIN) X2.1(OSC1)
1XOUT: R16.2 U7.21(XOUT)
CONT_DM: U1.19(GPIO12/USB_D-) U2.7(DM1)
CONT_DP: U1.20(GPIO13/USB_D+) U2.8(DP1)
LED_IN: FPC1.29 U1.10(GPIO10)
MUL0_A0: FPC1.26 U1.31(GPIO16/U0TXD)
MUL0_A1: FPC1.25 U1.30(GPIO17/U0RXD)
MUL0_A2: FPC1.24 U1.29(GPIO15/JTAG)
MUL0_OUT: FPC1.27 U1.7(GPIO0)
MUL1_A0: FPC1.21 U1.28(GPIO23)
MUL1_A1: FPC1.20 U1.27(GPIO22)
MUL1_A2: FPC1.19 U1.26(GPIO21)
MUL1_OUT: FPC1.22 U1.8(GPIO1)
MUL2_A0: FPC1.16 U1.25(GPIO20)
MUL2_A1: FPC1.15 U1.24(GPIO19)
MUL2_A2: FPC1.14 U1.23(GPIO18)
MUL2_OUT: FPC1.17 U1.11(GPIO11)
PMOSO: CARD1.4(VDD) U4.2(PMOSO)
RE1_CLK: FPC1.11 U10.18(GPA1)
RE1_DT: FPC1.10 U10.17(GPA0)
RE1_SW: FPC1.12 U10.19(GPA2)
RE2_CLK: FPC1.7 U10.22(GPA5)
RE2_DT: FPC1.6 U10.21(GPA4)
RE2_SW: FPC1.8 U10.23(GPA6)
RE3_CLK: FPC1.3 U10.26(GPB1)
RE3_DT: FPC1.2 U10.25(GPB0)
RE3_SW: FPC1.4 U10.27(GPB2)
RMIN_DM: R14.2 U3.7(DM1)
RMIN_DP: R15.2 U3.8(DP1)
RMOUT_DM: R12.2 U2.9(DM)
RMOUT_DP: R13.2 U2.10(DP)
SCL: FPC1.30 R20.1 U1.6(GPIO7) U10.8(SCK)
SD_CD: CARD1.10(CD) U4.15(SD_CDZ)
SD_CLK: CARD1.5(CLK) U4.20(SD_CLK)
SD_CMD: CARD1.2(CMD) U4.22(SD_CMD)
SD_DAT0: CARD1.7(DAT0) R8.1 U4.17(D0)
SD_DAT1: CARD1.8(DAT1) R9.1 U4.16(D1)
SD_DAT2: CARD1.9(DAT2) R6.1 U4.25(D2)
SD_DAT3: CARD1.1(CD/DAT3) R7.1 U4.24(D3)
SD_DM: R10.1 U3.1(DM4)
SD_DP: R11.1 U3.2(DP4)
SDA: FPC1.31 R19.1 U1.5(GPIO6) U10.9(SDA)
USB1_DM: U2.5(DM2) USB1.2(D-)
USB1_DP: U2.6(DP2) USB1.3(D+)
USB2_DM: U2.3(DM3) USB2.2(D-)
USB2_DP: U2.4(DP3) USB2.3(D+)
USB3_DM: U2.1(DM4) USB3.2(D-)
USB3_DP: U2.2(DP4) USB3.3(D+)
USB4_DM: U3.5(DM2) USB4.2(D-)
USB4_DP: U3.6(DP2) USB4.3(D+)
USB5_DM: U3.3(DM3) USB5.2(D-)
USB5_DP: U3.4(DP3) USB5.3(D+)
USBIN_DM: U3.9(DM) USBIN.2(D-)
USBIN_DP: U3.10(DP) USBIN.3(D+)
$1N2452: SW_CONFIG.6 U10.1(GPB4)
$1N2456: SW_CONFIG.5 U10.2(GPB5)
$1N2461: SW_CONFIG.4 U10.3(GPB6)
$1N2542: SW1.1 U1.12(GPIO2)
$1N2585: SW2.1 U1.13(GPIO3)
$2N2231: D1.2(A) USBIN.1(VBUS)
$2N2281: C1.1 D1.1(C) SW3.2
$2N3368: C8.2 U3.14(VDD18)
$2N3458: C6.2 U2.14(VDD18)
$2N3463: C7.2 U2.13(VDD33)
$3N1914: R1.2 U4.10(RREF)
$3N2120: R3.2 U4.1(GPIO1)
$3N2259: U4.4(X1) X1.1(OSC1)
$3N2263: C10.2 C11.2 U4.5(X2) X1.2(OSC2)
$3N2426: C9.1 R2.2 U4.13(EXTRSTZ)
$3N2556: R4.1 U4.28(GPIO0)
$3N2560: R5.1 U4.27(GPIO3)
$3N2602: R4.2 U5.1(A)
$3N2642: R5.2 U6.1(A)
$3N3390: R10.2 U4.9(DM)
$3N3470: R11.2 U4.8(DP)
$5N921: R12.1 U7.47(USB_DP)
$5N964: R13.1 U7.46(USB_DM)
$5N1124: R14.1 U7.27(GPIO16)
$5N1128: R15.1 U7.28(GPIO17)
$5N1687: C14.2 R16.1 X2.3(OSC2)
$5N2364: R18.1 SW_BOOT.2

Not connected (* = marked no-connect by the designer): CARD1 11(WP)*; SW3 3*; U1 1(3V3)* 2(EN/RESET)* 3(GPIO4/MTMS)* 4(GPIO5/MTDI)* 9(GPIO8/BOOT)* 16(NC)* 17(NC)* 22(GPIO9/BOOT)*; U2 15(XOUT)*; U3 15(XOUT)*; U4 18(D7)* 19(D6)* 21(D5)* 23(D4)* 26(MS_INS)*; U7 2(GPIO0)* 3(GPIO1)* 4(GPIO2)* 5(GPIO3)* 6(GPIO4)* 7(GPIO5)* 8(GPIO6)* 9(GPIO7)* 11(GPIO8)* 12(GPIO9)* 13(GPIO10)* 14(GPIO11)* 15(GPIO12)* 16(GPIO13)* 17(GPIO14)* 18(GPIO15)* 24(SWCLK)* 25(SWD)* 26(RUN)* 29(GPIO18)* 30(GPIO19)* 31(GPIO20)* 32(GPIO21)* 34(GPIO22)* 35(GPIO23)* 36(GPIO24)* 37(GPIO25)* 38(GPIO26_ADC0)* 39(GPIO27_ADC1)* 40(GPIO28_ADC2)* 41(GPIO29_ADC3)*; U9 4(NC)*; U10 4(GPB7)* 7(NC)* 10(NC)* 15(INTB)* 16(INTA)* 20(GPA3)* 24(GPA7)* 28(GPB3)* 29(EP)*; USBIN 4(ID)*
